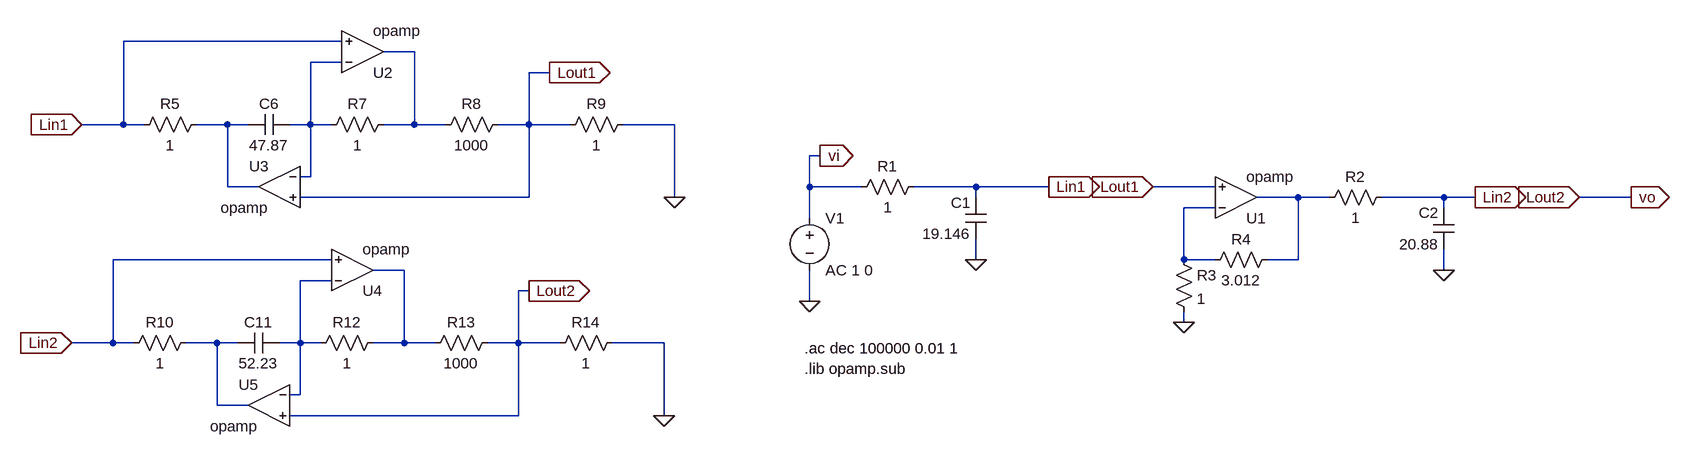
[diagram p0: schematic 20240513_Ejercicio1_d_v2.asc]
20240513_Ejercicio1_d_v2.asc, the LTspice schematic file:
Version 4
SHEET 1 1800 1076
WIRE -608 448 -944 448
WIRE -496 464 -544 464
WIRE -608 480 -656 480
WIRE -288 496 -320 496
WIRE -944 576 -944 448
WIRE -944 576 -1008 576
WIRE -912 576 -944 576
WIRE -784 576 -832 576
WIRE -752 576 -784 576
WIRE -656 576 -656 480
WIRE -656 576 -688 576
WIRE -624 576 -656 576
WIRE -496 576 -496 464
WIRE -496 576 -544 576
WIRE -448 576 -496 576
WIRE -320 576 -320 496
WIRE -320 576 -368 576
WIRE -256 576 -320 576
WIRE -96 576 -176 576
WIRE 128 624 112 624
WIRE -656 656 -656 576
WIRE -656 656 -672 656
WIRE -784 672 -784 576
WIRE -736 672 -784 672
WIRE 112 672 112 624
WIRE 192 672 112 672
WIRE 368 672 272 672
WIRE 480 672 368 672
WIRE 736 672 640 672
WIRE -320 688 -320 576
WIRE -320 688 -672 688
WIRE -96 688 -96 576
WIRE 368 688 368 672
WIRE 864 688 800 688
WIRE 912 688 864 688
WIRE 1088 688 992 688
WIRE 1136 688 1088 688
WIRE 1376 688 1296 688
WIRE 736 704 688 704
WIRE 1088 704 1088 688
WIRE 112 720 112 672
WIRE -624 784 -960 784
WIRE 368 784 368 752
WIRE 688 784 688 704
WIRE 736 784 688 784
WIRE 864 784 864 688
WIRE 864 784 816 784
WIRE -512 800 -560 800
WIRE 1088 800 1088 768
WIRE -624 816 -672 816
WIRE -320 832 -336 832
WIRE 112 848 112 800
WIRE 688 880 688 864
WIRE -960 912 -960 784
WIRE -960 912 -1024 912
WIRE -928 912 -960 912
WIRE -800 912 -848 912
WIRE -768 912 -800 912
WIRE -672 912 -672 816
WIRE -672 912 -704 912
WIRE -640 912 -672 912
WIRE -512 912 -512 800
WIRE -512 912 -560 912
WIRE -464 912 -512 912
WIRE -336 912 -336 832
WIRE -336 912 -384 912
WIRE -272 912 -336 912
WIRE -112 912 -192 912
WIRE -672 992 -672 912
WIRE -672 992 -688 992
WIRE -800 1008 -800 912
WIRE -752 1008 -800 1008
WIRE -336 1024 -336 912
WIRE -336 1024 -688 1024
WIRE -112 1024 -112 912
FLAG 112 848 0
FLAG 1088 800 0
FLAG 688 880 0
FLAG -1008 576 Lin1
IOPIN -1008 576 In
FLAG -288 496 Lout1
IOPIN -288 496 Out
FLAG 1296 688 Lout2
IOPIN 1296 688 In
FLAG 1136 688 Lin2
IOPIN 1136 688 Out
FLAG 480 672 Lin1
IOPIN 480 672 Out
FLAG 640 672 Lout1
IOPIN 640 672 In
FLAG -1024 912 Lin2
IOPIN -1024 912 In
FLAG -320 832 Lout2
IOPIN -320 832 Out
FLAG 1376 688 vo
IOPIN 1376 688 Out
FLAG 128 624 vi
IOPIN 128 624 Out
FLAG 368 784 0
FLAG -96 688 0
FLAG -112 1024 0
SYMBOL cap 384 752 R180
WINDOW 0 24 56 Left 2
WINDOW 3 24 8 Left 2
SYMATTR InstName C1
SYMATTR Value 19.146
SYMATTR SpiceLine Rser=0
SYMBOL voltage 112 704 R0
SYMATTR InstName V1
SYMATTR Value AC 1 0
SYMBOL res 288 656 R90
WINDOW 0 0 56 VBottom 2
WINDOW 3 32 56 VTop 2
SYMATTR InstName R1
SYMATTR Value 1
SYMBOL cap 1104 768 R180
WINDOW 0 24 56 Left 2
WINDOW 3 24 8 Left 2
SYMATTR InstName C2
SYMATTR Value 20.88
SYMATTR SpiceLine Rser=0
SYMBOL res 1008 672 R90
WINDOW 0 0 56 VBottom 2
WINDOW 3 32 56 VTop 2
SYMATTR InstName R2
SYMATTR Value 1
SYMBOL OpAmps\\opamp 768 752 M180
SYMATTR InstName U1
SYMBOL res 672 768 R0
SYMATTR InstName R3
SYMATTR Value 1
SYMBOL res 832 768 R90
WINDOW 0 0 56 VBottom 2
WINDOW 3 32 56 VTop 2
SYMATTR InstName R4
SYMATTR Value 3.012
SYMBOL OpAmps\\opamp -576 528 M180
SYMATTR InstName U2
SYMBOL OpAmps\\opamp -704 608 M0
SYMATTR InstName U3
SYMBOL res -816 560 R90
WINDOW 0 0 56 VBottom 2
WINDOW 3 32 56 VTop 2
SYMATTR InstName R5
SYMATTR Value 1
SYMBOL res -528 560 R90
WINDOW 0 0 56 VBottom 2
WINDOW 3 32 56 VTop 2
SYMATTR InstName R7
SYMATTR Value 1
SYMBOL res -352 560 R90
WINDOW 0 0 56 VBottom 2
WINDOW 3 32 56 VTop 2
SYMATTR InstName R8
SYMATTR Value 1000
SYMBOL res -160 560 R90
WINDOW 0 0 56 VBottom 2
WINDOW 3 32 56 VTop 2
SYMATTR InstName R9
SYMATTR Value 1
SYMBOL cap -688 560 R90
WINDOW 0 0 32 VBottom 2
WINDOW 3 32 32 VTop 2
SYMATTR InstName C6
SYMATTR Value 47.87
SYMBOL OpAmps\\opamp -592 864 M180
SYMATTR InstName U4
SYMBOL OpAmps\\opamp -720 944 M0
SYMATTR InstName U5
SYMBOL res -832 896 R90
WINDOW 0 0 56 VBottom 2
WINDOW 3 32 56 VTop 2
SYMATTR InstName R10
SYMATTR Value 1
SYMBOL res -544 896 R90
WINDOW 0 0 56 VBottom 2
WINDOW 3 32 56 VTop 2
SYMATTR InstName R12
SYMATTR Value 1
SYMBOL res -368 896 R90
WINDOW 0 0 56 VBottom 2
WINDOW 3 32 56 VTop 2
SYMATTR InstName R13
SYMATTR Value 1000
SYMBOL res -176 896 R90
WINDOW 0 0 56 VBottom 2
WINDOW 3 32 56 VTop 2
SYMATTR InstName R14
SYMATTR Value 1
SYMBOL cap -704 896 R90
WINDOW 0 0 32 VBottom 2
WINDOW 3 32 32 VTop 2
SYMATTR InstName C11
SYMATTR Value 52.23
TEXT 104 920 Left 2 !.ac dec 100000 0.01 1
TEXT 104 952 Left 2 !.lib opamp.sub

The netlist it stands for:
* 20240513_Ejercicio1_d_v2.asc
C1 0 Lin1 19.146 Rser=0
V1 vi 0 AC 1 0
R1 Lin1 vi 1
C2 0 Lin2 20.88 Rser=0
R2 Lin2 N004 1
XU1 N005 Lout1 N004 opamp Aol=100K GBW=10Meg  ; pins invin noninvin out
R3 N005 0 1
R4 N004 N005 3.012
XU2 N002 Lin1 N001 opamp Aol=100K GBW=10Meg  ; pins invin noninvin out
XU3 N002 Lout1 N003 opamp Aol=100K GBW=10Meg  ; pins invin noninvin out
R5 N003 Lin1 1
R7 N001 N002 1
R8 Lout1 N001 1000
R9 0 Lout1 1
C6 N002 N003 47.87
XU4 N007 Lin2 N006 opamp Aol=100K GBW=10Meg  ; pins invin noninvin out
XU5 N007 vo N008 opamp Aol=100K GBW=10Meg  ; pins invin noninvin out
R10 N008 Lin2 1
R12 N006 N007 1
R13 vo N006 1000
R14 0 vo 1
C11 N007 N008 52.23
.ac dec 100000 0.01 1
.lib opamp.sub
.backanno
.end